# EAGLE design clock (EAGLE 9.4.2)
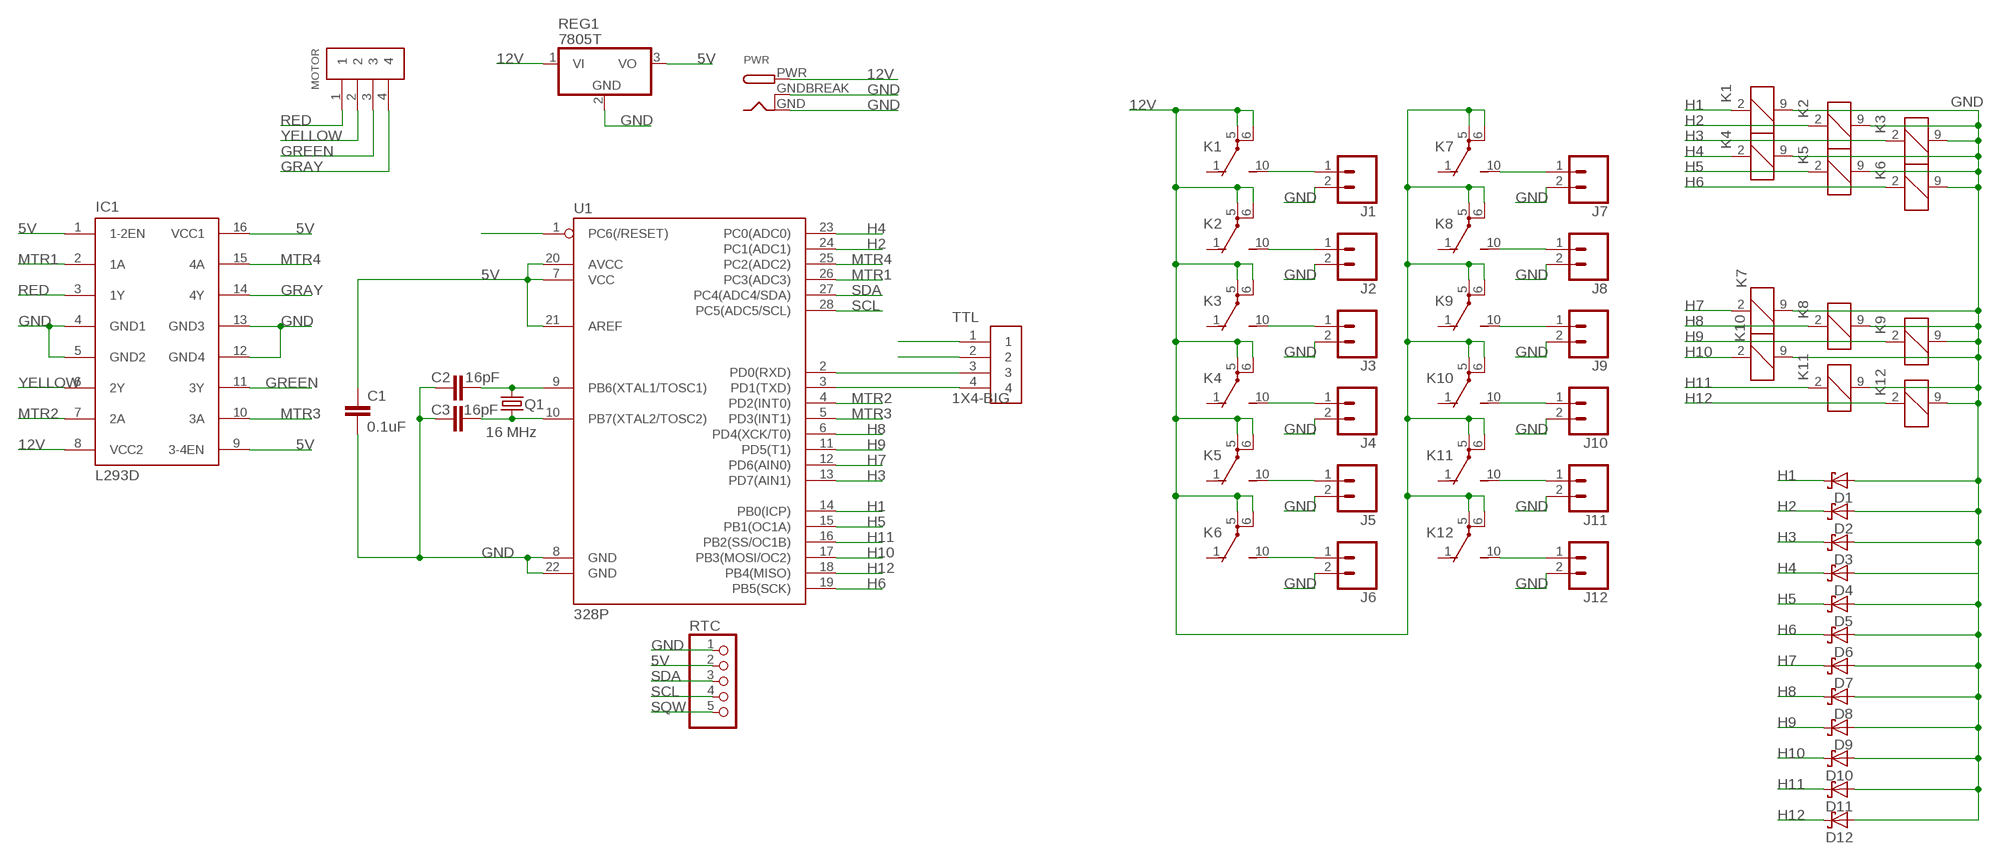
[diagram p0: schematic, sheet 1]

## Parts
C1  0.1uF  C-EUC1206  [C1206]
C2  16pF  C-EUC0805  [C0805]
C3  16pF  C-EUC0805  [C0805]
D1  SCHOTTKY-DIODEDO41-7  [DO41-7]
D2  SCHOTTKY-DIODEDO41-7  [DO41-7]
D3  SCHOTTKY-DIODEDO41-7  [DO41-7]
D4  SCHOTTKY-DIODEDO41-7  [DO41-7]
D5  SCHOTTKY-DIODEDO41-7  [DO41-7]
D6  SCHOTTKY-DIODEDO41-7  [DO41-7]
D7  SCHOTTKY-DIODEDO41-7  [DO41-7]
D8  SCHOTTKY-DIODEDO41-7  [DO41-7]
D9  SCHOTTKY-DIODEDO41-7  [DO41-7]
D10  SCHOTTKY-DIODEDO41-7  [DO41-7]
D11  SCHOTTKY-DIODEDO41-7  [DO41-7]
D12  SCHOTTKY-DIODEDO41-7  [DO41-7]
IC1  L293D  [DIL16]
J1  CONN_02  [1X02]
J2  CONN_02  [1X02]
J3  CONN_02  [1X02]
J4  CONN_02  [1X02]
J5  CONN_02  [1X02]
J6  CONN_02  [1X02]
J7  CONN_02  [1X02]
J8  CONN_02  [1X02]
J9  CONN_02  [1X02]
J10  CONN_02  [1X02]
J11  CONN_02  [1X02]
J12  CONN_02  [1X02]
K1  G5V1  [G5V1]
K2  G5V1  [G5V1]
K3  G5V1  [G5V1]
K4  G5V1  [G5V1]
K5  G5V1  [G5V1]
K6  G5V1  [G5V1]
K7  G5V1  [G5V1]
K8  G5V1  [G5V1]
K9  G5V1  [G5V1]
K10  G5V1  [G5V1]
K11  G5V1  [G5V1]
K12  G5V1  [G5V1]
MOTOR  1X4-BIG  [1X04-BIG]
PWR  DCBARRELPTH  [DCJACK_2MM_PTH]
Q1  16 MHz  CRYSTALHC49S  [HC49/S]
REG1  7805T  [TO220H]
RTC  PINHD-1X5  [1X05]
TTL  1X4-BIG  [1X04-BIG]
U1  328P  ATMEGA328P_PDIP  [DIP28]

## Nets
5V: C1.1 IC1.1(1-2EN) IC1.9(3-4EN) IC1.16(VCC1) REG1.3(VO) RTC.2 U1.7(VCC) U1.20(AVCC) U1.21(AREF)
12V: IC1.8(VCC2) K1.5(2:P) K1.6(2:P) K2.5(2:P) K2.6(2:P) K3.5(2:P) K3.6(2:P) K4.5(2:P) K4.6(2:P) K5.5(2:P) K5.6(2:P) K6.5(2:P) K6.6(2:P) K7.5(2:P) K7.6(2:P) K8.5(2:P) K8.6(2:P) K9.5(2:P) K9.6(2:P) K10.5(2:P) K10.6(2:P) K11.5(2:P) K11.6(2:P) K12.5(2:P) K12.6(2:P) PWR.PWR REG1.1(VI)
GND: C1.2 C2.1 C3.1 D1.A D2.A D3.A D4.A D5.A D6.A D7.A D8.A D9.A D10.A D11.A D12.A IC1.4(GND1) IC1.5(GND2) IC1.12(GND4) IC1.13(GND3) J1.2 J2.2 J3.2 J4.2 J5.2 J6.2 J7.2 J8.2 J9.2 J10.2 J11.2 J12.2 K1.9 K2.9 K3.9 K4.9 K5.9 K6.9 K7.9 K8.9 K9.9 K10.9 K11.9 K12.9 PWR.GND PWR.GNDBREAK REG1.2(GND) RTC.1 U1.8(GND) U1.22(GND)
GRAY: IC1.14(4Y) MOTOR.4
GREEN: IC1.11(3Y) MOTOR.3
H1: D1.C K1.2 U1.14(PB0(ICP))
H2: D2.C K2.2 U1.24(PC1(ADC1))
H3: D3.C K3.2 U1.13(PD7(AIN1))
H4: D4.C K4.2 U1.23(PC0(ADC0))
H5: D5.C K5.2 U1.15(PB1(OC1A))
H6: D6.C K6.2 U1.19(PB5(SCK))
H7: D7.C K7.2 U1.12(PD6(AIN0))
H8: D8.C K8.2 U1.6(PD4(XCK/T0))
H9: D9.C K9.2 U1.11(PD5(T1))
H10: D10.C K10.2 U1.17(PB3(MOSI/OC2))
H11: D11.C K11.2 U1.16(PB2(SS/OC1B))
H12: D12.C K12.2 U1.18(PB4(MISO))
MTR1: IC1.2(1A) U1.26(PC3(ADC3))
MTR2: IC1.7(2A) U1.4(PD2(INT0))
MTR3: IC1.10(3A) U1.5(PD3(INT1))
MTR4: IC1.15(4A) U1.25(PC2(ADC2))
N$1: J1.1 K1.10(2:S)
N$2: J2.1 K2.10(2:S)
N$3: J3.1 K3.10(2:S)
N$4: J4.1 K4.10(2:S)
N$5: J5.1 K5.10(2:S)
N$6: J6.1 K6.10(2:S)
N$7: J7.1 K7.10(2:S)
N$8: J8.1 K8.10(2:S)
N$9: J9.1 K9.10(2:S)
N$10: J10.1 K10.10(2:S)
N$11: J11.1 K11.10(2:S)
N$12: J12.1 K12.10(2:S)
N$13: C2.2 Q1.2 U1.9(PB6(XTAL1/TOSC1))
N$14: C3.2 Q1.1 U1.10(PB7(XTAL2/TOSC2))
N$15: TTL.3 U1.2(PD0(RXD))
N$16: TTL.4 U1.3(PD1(TXD))
N$17: TTL.2
N$18: TTL.1
N$19: U1.1(PC6(/RESET))
RED: IC1.3(1Y) MOTOR.1
SCL: RTC.4 U1.28(PC5(ADC5/SCL))
SDA: RTC.3 U1.27(PC4(ADC4/SDA))
SQW: RTC.5
YELLOW: IC1.6(2Y) MOTOR.2
Unconnected: K1.1(2:O) K2.1(2:O) K3.1(2:O) K4.1(2:O) K5.1(2:O) K6.1(2:O) K7.1(2:O) K8.1(2:O) K9.1(2:O) K10.1(2:O) K11.1(2:O) K12.1(2:O)

## Library data of the parts
C1-C3 = rcl:C-EU: CAPACITOR, European symbol; SPICEPREFIX: C
D1-D12 = adafruit:SCHOTTKY-DIODE: Schottky Diode
IC1 = st-microelectronics:L293D: PUSH-PULL 4 CHANNEL DRIVER; MPN: L293D; OC_FARNELL: 9589619; OC_NEWARK: 56P8249
J1-J12 = SparkFun-Connectors:CONN_02: Multi connection point. Often used as Generic Header-pin footprint for 0.1 inch spaced/style header connections On any of the 0.1 inch spaced packages, you can populate with these: Break Away Headers - Straight <https://www.sparkfun.com/products/116> (PRT-00116) Break Away Male Headers - Right Angle <https://www.sparkfun.com/products/553> (PRT-00553) Female Headers <https://www.sparkfun.com/products/115> (PRT-00115) Break Away Headers - Machine Pin <https://www.sparkfun.com/products/117> (PRT-00117) Break Away Female Headers - Swiss Machine Pin <https://www.sparkfun.com/products/743> (PRT-00743) For SCREWTERMINALS and SPRING TERMINALS visit here: Screw Terimnals on SparkFun.com <https://www.sparkfun.com/search/results?term=Screw+Terminals> (5mm/3.5mm/2.54mm spacing) This device is also useful as a general connection point to wire up your design to another part of your project. Our various solder wires solder well into these plated through hole pads. Hook-Up Wire - Assortment (Stranded, 22 AWG) <https://www.sparkfun.com/products/11375> (PRT-11375) Hook-Up Wire - Assortment (Solid Core, 22 AWG) <https://www.sparkfun.com/products/11367> (PRT-11367) View the entire wire category on our website here <https://www.sparkfun.com/categories/141> Special notes: Molex polarized connector foot print use with: PRT-08233 with associated crimp pins and housings. 2.54_SCREWTERM for use with PRT-10571. 3.5mm Screw Terminal footprints for PRT-08084 5mm Screw Terminal footprints for use with PRT-08432
K1-K12 = relay:G5V1: RELAY 1 x switch, 0.5 A/125 V AC, 1 A/24 V DC , Omron; MPN: G5V-1-DC24; OC_FARNELL: 9949593; OC_NEWARK: 36M6377
MOTOR TTL = adafruit:1X4: 4-pin connector
PWR = adafruit:DCBARREL: 2.0mm DC Barrel Jack DCJACK_2MM_PTH - Through Hole Jack (4UConnector: 05537)
Q1 = adafruit:CRYSTAL: CRYSTAL; OC_FARNELL: 1667008; OC_NEWARK: unknown
REG1 = adafruit:78*: Positive VOLTAGE REGULATOR Added bigger pads to the TO-92 package
RTC = pinhead:PINHD-1X5: PIN HEADER
U1 = SparkFun-IC-Microcontroller:ATMEGA328P_PDIP: Atmel 328P Through hole ATMEGA328P uC used in the Arduino 32kb flash, 1k EEPROM, 2k SRAM Datasheet <http://www.sparkfun.com/datasheets/Components/SMD/ATMega328.pdf> SparkFun Products Storefront component: AVR 28 Pin 20MHz 32K 6A/D - ATMega328P <https://www.sparkfun.com/products/9061> (COM-09061) SparkFun Simon Says - Through-Hole Soldering Kit <https://www.sparkfun.com/products/10547> (KIT-10547) SparkFun Learn to Solder - Simon Says <https://www.sparkfun.com/products/13708> (KIT-13708) SparkFun BigTime Watch Kit <https://www.sparkfun.com/products/11734> (KIT-11734) SparkFun ClockIt <https://www.sparkfun.com/products/10930> (KIT-10930) SparkFun Serial Enabled LCD Kit <https://www.sparkfun.com/products/10097> (LCD-10097) SparkFun Simon Tilts - Through Hole Soldering Kit <https://www.sparkfun.com/products/12634> (KIT-12634) SparkFun Frequency Counter Kit <https://www.sparkfun.com/products/10140> (KIT-10140) FabFM Radio Kit <https://www.sparkfun.com/products/11043> (KIT-11043) SparkFun Binary Blaster Kit <https://www.sparkfun.com/products/12037> (KIT-12037) SparkFun Metro-Gnome <https://www.sparkfun.com/products/9236> (KIT-09236) ATmega328 with Arduino Optiboot (Uno) <https://www.sparkfun.com/products/10524> (DEV-10524); PROD_ID: IC-09136

## Board
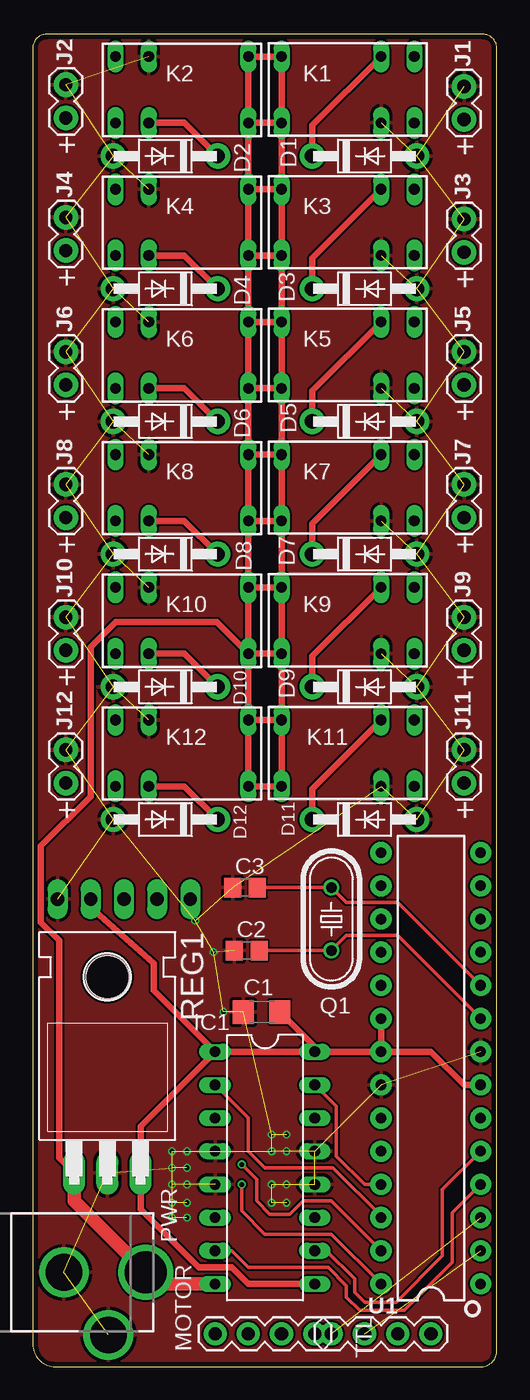
[diagram p1: board, top side]
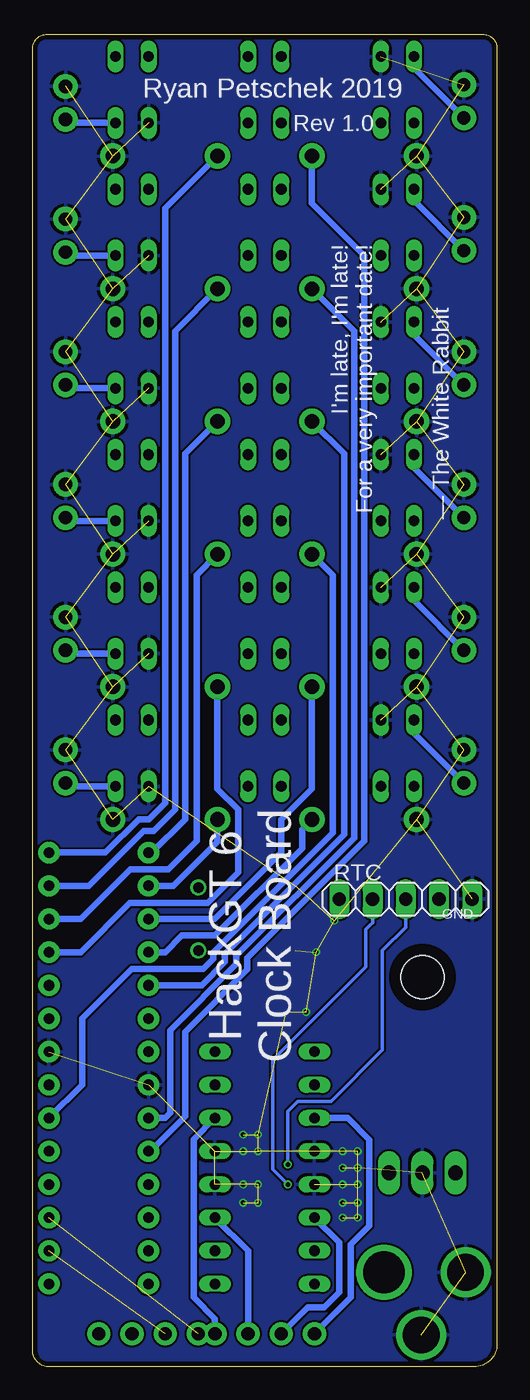
[diagram p2: board, bottom side, seen from below]

Size 35.54 x 102.03 mm. Coordinates in mm from the lower left corner, seen from the top.
Outline: 0,100.97 0,1.73 arc90 1.73,0 34.27,0 arc90 35.54,1.27 35.54,100.95 arc90 34.46,102.03 1.06,102.03 arc90 0,100.97
Copper layers (1*16): Top 0.035559375mm / dielectric 1.6mm / Bottom 0.035559375mm
Design rules "oshpark-2layer": minimum track width 6mil, minimum drill 10mil, track to track 6mil, track to pad 6mil, pad to pad 6mil, via to via 6mil, smd to smd 6mil, copper to edge 15mil, drill to drill 6mil, minimum pad ring 5mil, minimum via ring 5mil, stop-mask expansion 2.5mil, vias tented up to drill 0mil, thermal gap 10mil

### Footprints (pad centres in the part's own frame; a part is rotated, then mirrored left to right if it is on the bottom)
C1206 = smd 1.6 x 1.8: 1 -1.4,0; 2 1.4,0
C0805 = smd 1.3 x 1.5: 1 -0.95,0; 2 0.95,0
DO41-7 = drill 1.118 pad 1.93: A 4,0; C -4,0
DIL16 = drill 0.813 long: 1 -8.89,-3.81; 2 -6.35,-3.81; 3 -3.81,-3.81; 4 -1.27,-3.81; 5 1.27,-3.81; 6 3.81,-3.81; 7 6.35,-3.81; 8 8.89,-3.81; 9 8.89,3.81; 10 6.35,3.81; 11 3.81,3.81; 12 1.27,3.81; 13 -1.27,3.81; 14 -3.81,3.81; 15 -6.35,3.81; 16 -8.89,3.81
1X02 = drill 1.016 pad 1.88: 1 0,0; 2 2.54,0
G5V1 = drill 0.813 long: 1 -5.08,-2.54; 2 -2.54,-2.54; 5 5.08,-2.54; 6 5.08,2.54; 9 -2.54,2.54; 10 -5.08,2.54
1X04-BIG = drill 1.016 pad 1.778: 1 0,0; 2 2.54,0; 3 5.08,0; 4 7.62,0
DCJACK_2MM_PTH = drill 2.8: GND 0,7.35; GNDBREAK 4.8,10.75 | drill 3.2: PWR 0,13.6
HC49/S = drill 0.813: 1 -2.413,0; 2 2.413,0
TO220H = drill 1.118 long: 1 -2.54,-10.16; 2 0,-10.16; 3 2.54,-10.16 | hole 3.302: 0,4.826
1X05 = drill 1.016 long: 1 -5.08,0; 2 -2.54,0; 3 0,0; 4 2.54,0; 5 5.08,0
DIP28 = drill 0.813 pad 1.626: 1 -16.51,-3.81; 2 -13.97,-3.81; 3 -11.43,-3.81; 4 -8.89,-3.81; 5 -6.35,-3.81; 6 -3.81,-3.81; 7 -1.27,-3.81; 8 1.27,-3.81; 9 3.81,-3.81; 10 6.35,-3.81; 11 8.89,-3.81; 12 11.43,-3.81; 13 13.97,-3.81; 14 16.51,-3.81; 15 16.51,3.81; 16 13.97,3.81; 17 11.43,3.81; 18 8.89,3.81; 19 6.35,3.81; 20 3.81,3.81; 21 1.27,3.81; 22 -1.27,3.81; 23 -3.81,3.81; 24 -6.35,3.81; 25 -8.89,3.81; 26 -11.43,3.81; 27 -13.97,3.81; 28 -16.51,3.81

### Placement (x,y rotation side)
C1  17.53,27.18 180 top
C2  16.38,31.88 0 top
C3  16.26,36.7 0 top
D1  25.4,92.71 0 top
D2  10.16,92.71 180 top
D3  25.4,82.55 0 top
D4  10.16,82.55 180 top
D5  25.4,72.39 0 top
D6  10.16,72.39 180 top
D7  25.4,62.23 0 top
D8  10.16,62.23 180 top
D9  25.4,52.07 0 top
D10  10.16,52.07 180 top
D11  25.4,41.91 0 top
D12  10.16,41.91 180 top
IC1  17.78,15.24 270 top
J1  33.02,95.5 90 top
J2  2.54,95.63 90 top
J3  33.02,85.34 90 top
J4  2.54,85.47 90 top
J5  33.02,75.18 90 top
J6  2.54,75.18 90 top
J7  33.02,65.02 90 top
J8  2.54,65.02 90 top
J9  33.02,54.86 90 top
J10  2.54,54.86 90 top
J11  33.02,44.7 90 top
J12  2.54,44.7 90 top
K1  24.13,97.79 180 top
K2  11.43,97.79 0 top
K3  24.13,87.63 180 top
K4  11.43,87.63 0 top
K5  24.13,77.47 180 top
K6  11.43,77.47 0 top
K7  24.13,67.31 180 top
K8  11.43,67.31 0 top
K9  24.13,57.15 180 top
K10  11.43,57.15 0 top
K11  24.13,46.99 180 top
K12  11.43,46.99 0 top
MOTOR  13.97,2.54 0 top
PWR  -4.95,7.24 270 top
Q1  22.86,34.29 270 top
REG1  5.71,25.02 0 top
RTC  6.99,35.81 180 bottom
TTL  30.48,2.54 180 top
U1  30.48,22.86 90 top

### Tracks (layer width: path | path; a pad name or v marks a point on that pad's centre or on a via)
5V
  Top 0.508: IC1.9 16.51,6.35 15.24,7.62 12.7,7.62 8.26,12.06 REG1.3 8.26,18.41 IC1.1 | IC1.1 IC1.16 | C1.1 21.59,24.51 IC1.16 | IC1.16 U1.21 | U1.20 U1.21 | U1.21 30.48,24.13 33.02,21.59 U1.7 | IC1.1 9.27,28.83 9.27,30.91 4.45,35.18 RTC.2
12V
  Top 0.508: REG1.1 2.03,16 2.03,32.64 0.64,34.04 0.64,39.88 4.45,43.69 4.45,55.12 6.35,57.02 14.1,57.02 K10.5 | K12.6 K12.5 K11.6 K11.5 | K12.6 K10.5 | K10.5 K10.6 | K10.6 K8.5 | K8.5 K8.6 | K8.6 K6.5 | K6.5 K6.6 | K6.6 K4.5 | K4.5 K4.6 | K4.6 K2.5 | K2.5 K2.6 K1.5 K1.6 | K2.5 K1.6 | K1.6 K3.5 | K3.5 K4.6 | K3.5 K3.6 | K3.6 K4.5 | K3.6 K5.5 | K5.5 K6.6 | K5.5 K5.6 | K5.6 K6.5 | K5.6 K7.5 | K7.5 K8.6 | K7.5 K7.6 | K7.6 K8.5 | K7.6 K9.5 | K9.5 K9.6 | K9.5 K10.6 | K10.5 K9.6 | K9.6 K11.5 | K11.5 K12.6
  Top 1.016: REG1.1 3.17,12.71 PWR.PWR 9.54,6.35 IC1.8
GND  (via drill 0.35)  (69 unrouted)
  other vias: 11.81,11.43 10.67,11.43 10.67,12.57 11.81,12.57 10.67,13.97 11.81,13.97 10.67,15.24 11.81,15.24 10.67,16.51 11.81,16.51 18.29,12.57 19.43,12.57 18.29,13.97 19.43,13.97 18.29,16.51 19.43,16.51 18.29,17.78 19.43,17.78 12.45,34.16 13.84,31.75 14.61,27.18
  pour Top: -5.08,104.14 40.64,104.14 40.64,-2.54 -6.35,-2.54 -6.35,102.87
  pour Bottom: -5.08,104.14 40.64,104.14 40.64,-2.54 -6.35,-2.54 -6.35,102.87
GRAY
  Bottom 0.508: MOTOR.4 21.59,3.68 23.22,5.31 23.22,17.42 IC1.14
GREEN
  Bottom 0.508: MOTOR.3 19.05,8.89 IC1.11
H1
  Top 0.508: D1.C 21.4,95.06 K1.2
  Bottom 0.508: D1.C 25.4,88.71 25.4,43.18 26.67,41.91 27.43,41.91 29.97,39.37 U1.14
H2
  Top 0.508: D2.C 11.62,95.25 K2.2
  Bottom 0.508: D2.C 14.16,89.09 10.16,85.09 10.16,40.26 19.11,31.3 19.11,30.42 23.88,25.65 23.88,19.18 26.54,16.51 U1.24
H3
  Top 0.508: D3.C 21.4,84.9 K3.2
  Bottom 0.508: D3.C 24.64,79.31 24.64,42.67 26.29,41.02 27.05,41.02 31.24,36.83 U1.13
H4
  Top 0.508: D4.C 11.62,85.09 K4.2
  Bottom 0.508: D4.C 10.92,79.31 10.92,40.51 19.94,31.5 19.94,30.86 25.02,25.78 25.02,19.43 25.4,19.05 U1.23
H5
  Top 0.508: D5.C 21.4,74.74 K5.2
  Bottom 0.508: D5.C 23.88,69.91 23.88,41.91 26.42,39.37 U1.15
H6
  Top 0.508: D6.C 11.62,74.93 K6.2
  Bottom 0.508: D6.C 11.68,69.91 11.68,40.77 20.83,31.62 20.83,30.99 22.61,29.21 U1.19
H7
  Top 0.508: D7.C 21.4,64.58 K7.2
  Bottom 0.508: D7.C 22.99,60.64 22.99,40.26 25.15,38.1 28.07,38.1 31.88,34.29 U1.12
H8
  Top 0.508: D8.C 11.62,64.77 K8.2
  Bottom 0.508: D8.C 12.57,60.64 12.57,40.89 21.72,31.75 21.72,31.24 22.48,30.48 27.94,30.48 31.75,26.67 31.75,21.59 U1.6
H9
  Top 0.508: D9.C 21.4,54.42 K9.2
  Bottom 0.508: D9.C 21.4,44.26 19.81,42.67 19.81,37.85 22.15,35.51 28.12,35.51 31.88,31.75 U1.11
H10
  Top 0.508: D10.C 11.62,54.61 K10.2
  Bottom 0.508: D10.C 14.16,44.26 16.51,41.91 16.51,39.37 21.59,34.29 U1.17
H11
  Top 0.508: K11.2 21.4,44.26 D11.C
  Bottom 0.508: D11.C 21.4,40.2 24.77,36.83 U1.16
H12
  Top 0.508: D12.C 11.62,44.45 K12.2
  Bottom 0.508: D12.C 14.92,41.15 14.92,39.69 21.59,33.02 24.13,33.02 25.4,31.75 U1.18
MTR1
  Top 0.254: U1.26 26.67,11.56 22.99,15.24 17.78,15.24 16.51,16.51 16.51,19.05 15.24,20.32 IC1.2
MTR2
  Top 0.254: IC1.7 15.24,8.89 16.51,7.62 22.61,7.62 24,6.22 24,5.33 25.02,4.32 28.45,4.32 32.13,8 32.13,11.81 U1.4
MTR3
  Top 0.254: IC1.10 22.48,8.89 24.64,6.73 24.64,5.71 25.4,4.95 27.81,4.95 31.37,8.51 31.37,13.59 U1.5
MTR4
  Top 0.254: U1.25 25.4,13.97 23.24,16.13 23.24,19.94 IC1.15
N$1
  Bottom 0.508: J1.1 32.77,95.25 K1.10
N$2
  Bottom 0.508: J2.1 6.35,99.44 K2.10
N$3
  Bottom 0.508: J3.1 32.77,85.09 K3.10
N$4
  Bottom 0.508: J4.1 6.35,89.28 K4.10
N$5
  Bottom 0.508: J5.1 32.77,74.93 K5.10
N$6
  Bottom 0.508: J6.1 6.35,78.99 K6.10
N$7
  Bottom 0.508: J7.1 32.77,64.77 K7.10
N$8
  Bottom 0.508: J8.1 6.35,68.83 K8.10
N$9
  Bottom 0.508: J9.1 32.77,54.61 K9.10
N$10
  Bottom 0.508: J10.1 6.35,58.67 K10.10
N$11
  Bottom 0.508: J11.1 32.77,44.45 K11.10
N$12
  Bottom 0.508: J12.1 6.35,48.51 K12.10
N$13
  Top 0.254: C2.2 Q1.2 24,33.02 27.94,33.02 U1.9
N$14
  Top 0.254: C3.2 Q1.1 24,35.56 27.94,35.56 U1.10
N$15  (1 unrouted)
N$16  (1 unrouted)
RED
  Bottom 0.508: MOTOR.1 11.18,5.33 11.18,9.4 9.78,10.79 9.78,17.4 11.43,19.05 IC1.3
SCL  (via drill 0.35)
  Top 0.254: U1.28 22.86,10.16 17.78,10.16 16,11.94 v16,13.97
  Bottom 0.254: v16,13.97 17.14,15.11 17.14,23.5 10.03,30.61 10.03,33.5 9.7,33.83 9.53,34 RTC.4
SDA  (via drill 0.35)
  Top 0.254: U1.27 22.86,12.7 20.7,12.7 19.68,11.68 18.16,11.68 17.14,12.7 17.14,14.35 v16,15.49
  Bottom 0.254: v16,15.49 16,19.56 15.24,20.32 12.7,20.32 8.76,24.26 8.76,31.88 6.99,33.66 RTC.3
YELLOW
  Bottom 0.508: IC1.6 12.06,9.53 12.06,5.71 13.21,4.57 14.48,4.57 MOTOR.2

### Text on the board
tNames: + | + | + | + | + | + | + | + | + | + | + | +
bNames: Ryan Petschek 2019 | Rev 1.0 | I'm late, I'm late! / For a very important date! | — The White Rabbit | GND | HackGT 6 / Clock Board